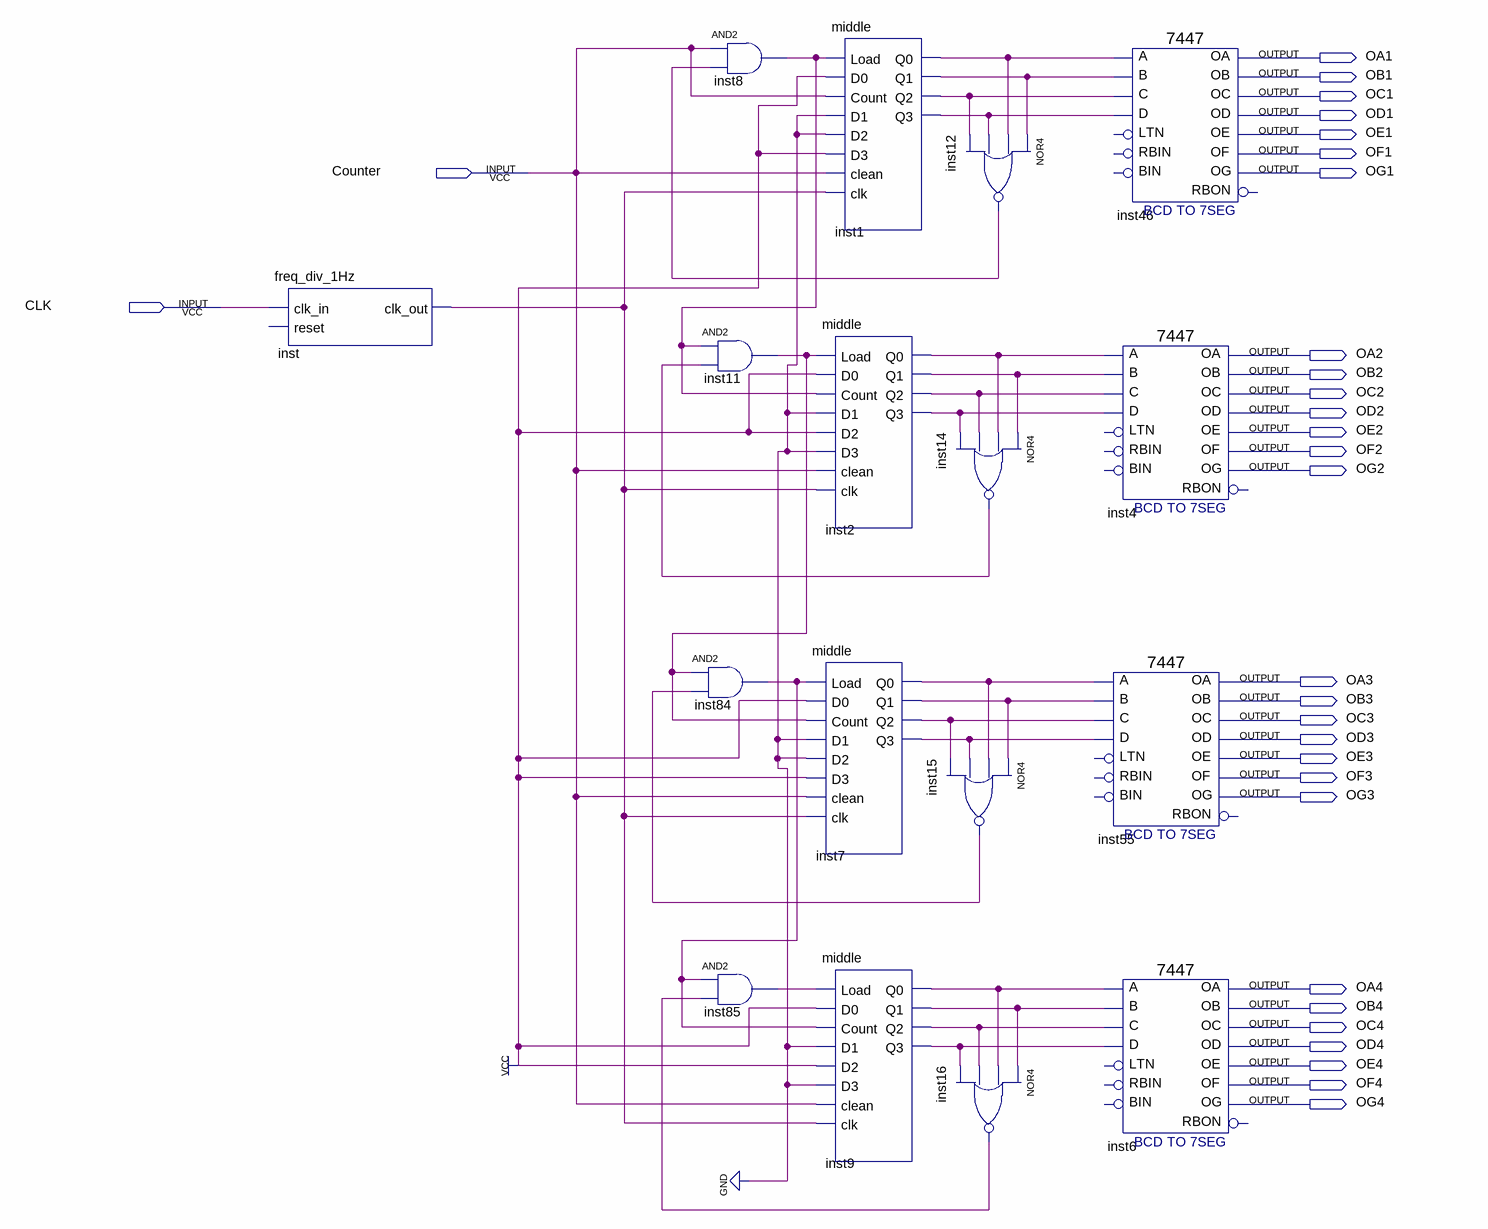
[diagram p0: schematic sheet]
// Quartus schematic middle2.bdf as structural Verilog: 17 symbols, 30 pins
module middle2 (
  input  Counter,
  input  CLK,
  output OA1,
  output OB1,
  output OC1,
  output OD1,
  output OE1,
  output OF1,
  output OG1,
  output OA2,
  output OB2,
  output OC2,
  output OD2,
  output OE2,
  output OF2,
  output OG2,
  output OA3,
  output OB3,
  output OC3,
  output OD3,
  output OE3,
  output OF3,
  output OG3,
  output OA4,
  output OB4,
  output OC4,
  output OD4,
  output OE4,
  output OF4,
  output OG4
);

  wire inst1_q0, inst1_q1, inst1_q2, inst1_q3, inst2_q0, inst2_q1, inst2_q2, inst2_q3, inst7_q0, inst7_q1,
       inst7_q2, inst7_q3, inst8_out, inst9_q0, inst9_q1, inst9_q2, inst9_q3, inst11_out, inst12_out,
       inst14_out, inst15_out, inst16_out, inst84_out, inst85_out, inst_clk_out;

  freq_div_1Hz inst (.clk_in(CLK), .clk_out(inst_clk_out));  // open: reset
  and inst8 (inst8_out, Counter, inst12_out);
  and inst11 (inst11_out, inst8_out, inst14_out);
  and inst84 (inst84_out, inst11_out, inst15_out);
  and inst85 (inst85_out, inst84_out, inst16_out);
  middle inst1 (
    .Load(inst8_out), .D0(1'b1), .Count(Counter), .D1(1'b0), .D2(1'b0), .D3(1'b1), .clean(Counter),
    .clk(inst_clk_out), .Q0(inst1_q0), .Q1(inst1_q1), .Q2(inst1_q2), .Q3(inst1_q3));
  middle inst2 (
    .Load(inst11_out), .D0(1'b1), .Count(inst8_out), .D1(1'b0), .D2(1'b1), .D3(1'b0), .clean(Counter),
    .clk(inst_clk_out), .Q0(inst2_q0), .Q1(inst2_q1), .Q2(inst2_q2), .Q3(inst2_q3));
  middle inst7 (
    .Load(inst84_out), .D0(1'b1), .Count(inst11_out), .D1(1'b0), .D2(1'b0), .D3(1'b1), .clean(Counter),
    .clk(inst_clk_out), .Q0(inst7_q0), .Q1(inst7_q1), .Q2(inst7_q2), .Q3(inst7_q3));
  middle inst9 (
    .Load(inst85_out), .D0(1'b1), .Count(inst84_out), .D1(1'b0), .D2(1'b1), .D3(1'b0), .clean(Counter),
    .clk(inst_clk_out), .Q0(inst9_q0), .Q1(inst9_q1), .Q2(inst9_q2), .Q3(inst9_q3));
  nor inst12 (inst12_out, inst1_q1, inst1_q0, inst1_q3, inst1_q2);
  nor inst14 (inst14_out, inst2_q1, inst2_q0, inst2_q2, inst2_q3);
  nor inst15 (inst15_out, inst7_q1, inst7_q0, inst7_q3, inst7_q2);
  nor inst16 (inst16_out, inst9_q1, inst9_q0, inst9_q2, inst9_q3);
  \7447  inst46 (
    .B(inst1_q1), .C(inst1_q2), .D(inst1_q3), .A(inst1_q0), .OB(OB1), .OC(OC1), .OE(OE1), .OD(OD1), .OF(OF1),
    .OG(OG1), .OA(OA1));  // open: LTN, RBIN, BIN, RBON
  \7447  inst4 (
    .B(inst2_q1), .C(inst2_q2), .D(inst2_q3), .A(inst2_q0), .OB(OB2), .OC(OC2), .OE(OE2), .OD(OD2), .OF(OF2),
    .OG(OG2), .OA(OA2));  // open: LTN, RBIN, BIN, RBON
  \7447  inst55 (
    .B(inst7_q1), .C(inst7_q2), .D(inst7_q3), .A(inst7_q0), .OB(OB3), .OC(OC3), .OE(OE3), .OD(OD3), .OF(OF3),
    .OG(OG3), .OA(OA3));  // open: LTN, RBIN, BIN, RBON
  \7447  inst6 (
    .B(inst9_q1), .C(inst9_q2), .D(inst9_q3), .A(inst9_q0), .OB(OB4), .OC(OC4), .OE(OE4), .OD(OD4), .OF(OF4),
    .OG(OG4), .OA(OA4));  // open: LTN, RBIN, BIN, RBON
endmodule
